# EAGLE design Arduino MEGA blank shield (EAGLE 5.11)
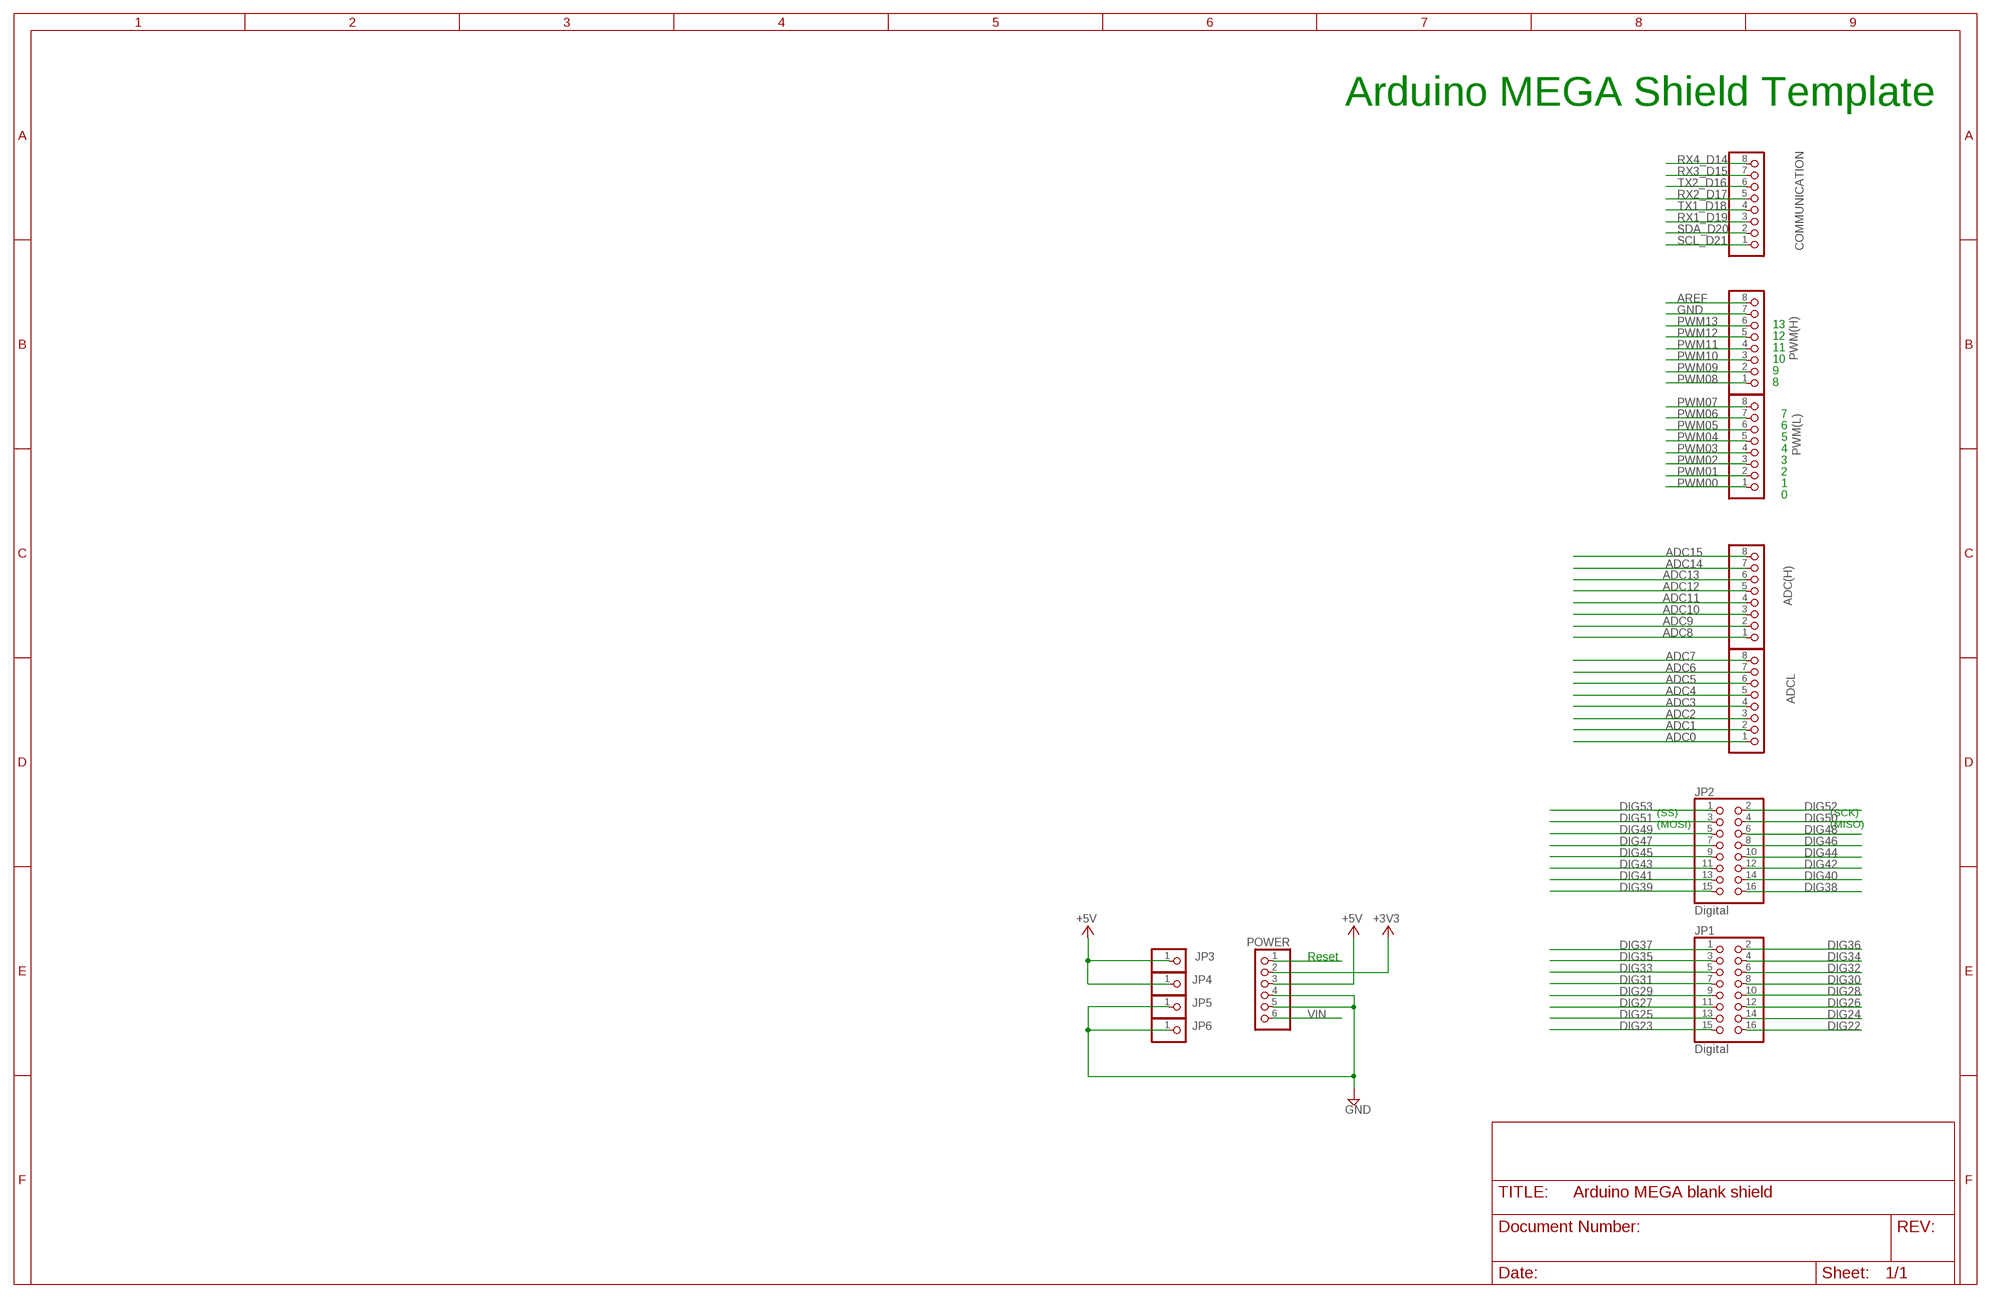
[diagram p0: schematic, sheet 1]

## Parts
ADC(H)  PINHD-1X8  [1X08]
ADCL  PINHD-1X8  [1X08]
COMMUNICATION  PINHD-1X8  [1X08]
JP1  Digital  PINHD-2X8  [2X08]
JP2  Digital  PINHD-2X8  [2X08]
JP3  PINHD-1X1  [1X01]
JP4  PINHD-1X1  [1X01]
JP5  PINHD-1X1  [1X01]
JP6  PINHD-1X1  [1X01]
POWER  PINHD-1X6  [1X06]
PWM(H)  PINHD-1X8  [1X08]
PWM(L)  PINHD-1X8  [1X08]

## Nets
+3V3 [power]: POWER.2
+5V [usbvcc]: JP3.1 JP4.1 POWER.3
ADC0: ADCL.1
ADC1: ADCL.2
ADC2: ADCL.3
ADC3: ADCL.4
ADC4: ADCL.5
ADC5: ADCL.6
ADC6: ADCL.7
ADC7: ADCL.8
ADC8: ADC(H).1
ADC9: ADC(H).2
ADC10: ADC(H).3
ADC11: ADC(H).4
ADC12: ADC(H).5
ADC13: ADC(H).6
ADC14: ADC(H).7
ADC15: ADC(H).8
AREF: PWM(H).8
DIG22: JP1.16
DIG23: JP1.15
DIG24: JP1.14
DIG25: JP1.13
DIG26 [gnd]: JP1.12
DIG27: JP1.11
DIG28: JP1.10
DIG29: JP1.9
DIG30: JP1.8
DIG31: JP1.7
DIG32: JP1.6
DIG33: JP1.5
DIG34: JP1.4
DIG35: JP1.3
DIG36: JP1.2
DIG37: JP1.1
DIG38: JP2.16
DIG39: JP2.15
DIG40: JP2.14
DIG41: JP2.13
DIG42: JP2.12
DIG43: JP2.11
DIG44: JP2.10
DIG45: JP2.9
DIG46: JP2.8
DIG47: JP2.7
DIG48: JP2.6
DIG49: JP2.5
DIG50: JP2.4
DIG51: JP2.3
DIG52: JP2.2
DIG53: JP2.1
GND [gnd]: JP5.1 JP6.1 POWER.4 POWER.5 PWM(H).7
PWM00: PWM(L).1
PWM01: PWM(L).2
PWM02: PWM(L).3
PWM03: PWM(L).4
PWM04: PWM(L).5
PWM05: PWM(L).6
PWM06: PWM(L).7
PWM07: PWM(L).8
PWM08: PWM(H).1
PWM09: PWM(H).2
PWM10: PWM(H).3
PWM11: PWM(H).4
PWM12: PWM(H).5
PWM13: PWM(H).6
RESET: POWER.1
RX1_D19: COMMUNICATION.3
RX2_D17: COMMUNICATION.5
RX3_D15: COMMUNICATION.7
RX4_D14: COMMUNICATION.8
SCL_D21: COMMUNICATION.1
SDA_D20: COMMUNICATION.2
TX1_D18: COMMUNICATION.4
TX2_D16: COMMUNICATION.6
VIN [power]: POWER.6

## Notes on the sheet
- Arduino MEGA Shield Template
- 13
- 12
- 11
- 10
- 9
- 8
- 7
- 6
- 5
- 4
- 3
- 2
- 1
- 0
- (SS) | (SCK)
- (MOSI) | (MISO)
- Reset

## Library data of the parts
ADC(H) ADCL COMMUNICATION PWM(H) PWM(L) = pinhead:PINHD-1X8: PIN HEADER
JP1 JP2 = pinhead:PINHD-2X8: PIN HEADER
JP3-JP6 = pinhead:PINHD-1X1: PIN HEADER
POWER = pinhead:PINHD-1X6: PIN HEADER

## Net classes
0 default: width 0.203 mm, drill 0.406 mm, clearance 0.203 mm
1 power: width 0.61 mm, drill 0.711 mm, clearance 0.203 mm
2 gnd: width 0.305 mm, drill 0.711 mm, clearance 0.203 mm
3 usbvcc: width 0.508 mm, drill 0.711 mm, clearance 0.203 mm

## Board
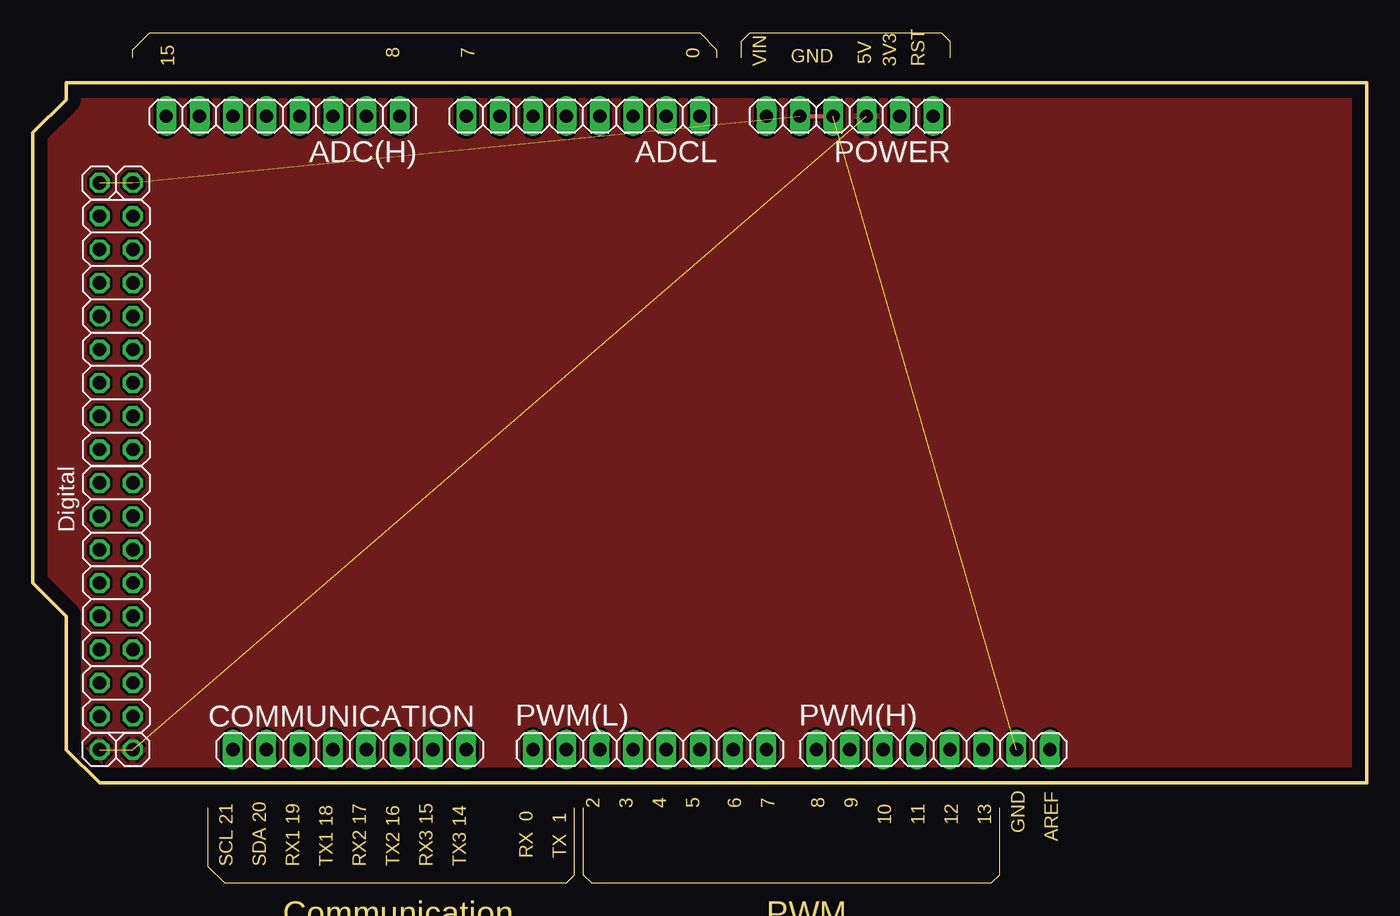
[diagram p1: board, top side]
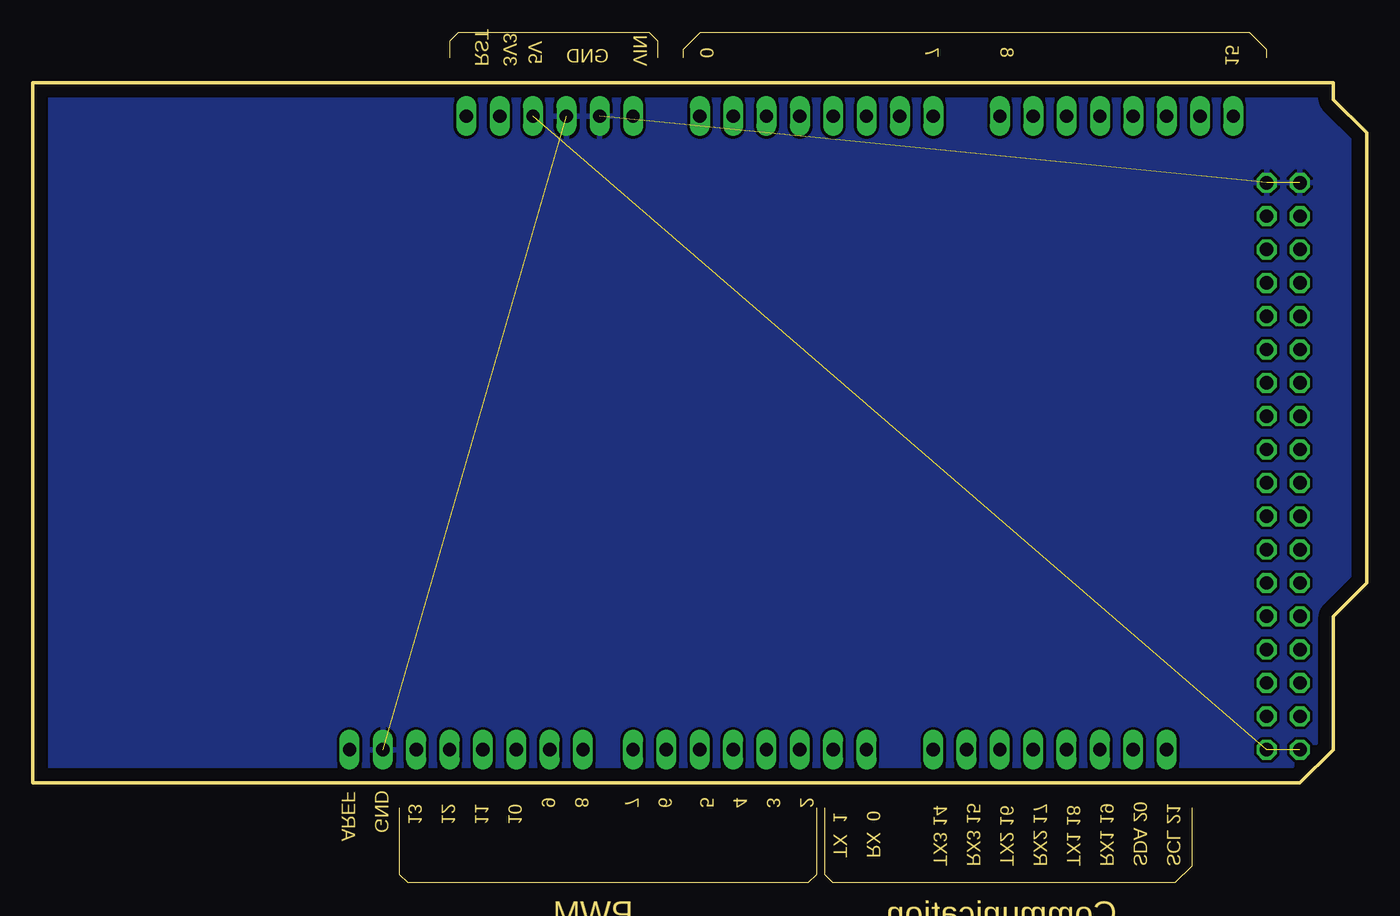
[diagram p2: board, bottom side, seen from below]

Size 101.6 x 64.77 mm. Coordinates in mm from the lower left corner, seen from the top.
Outline: 7.62,62.87 7.62,63.5 8.89,64.77 50.8,64.77 52.07,63.5 52.07,62.87
Outline: 53.98,62.87 53.98,64.13 54.61,64.77 69.22,64.77 69.85,64.13 69.85,62.87
Outline: 13.34,5.71 13.34,1.27 14.61,0 40.64,0 41.27,0.64 41.27,5.71
Outline: 41.91,5.71 41.91,0.64 42.55,0 73.03,0 73.66,0.64 73.66,5.71
Outline: 101.6,7.62 5.08,7.62 2.54,10.16 2.54,20.32 0,22.86 0,57.15 2.54,59.69 2.54,60.96 101.6,60.96 101.6,7.62
Copper layers (1*16): Top 0.035mm / dielectric 1.5mm / Bottom 0.035mm
Design rules "default *": minimum track width 8mil, minimum drill 16mil, track to track 8mil, track to pad 8mil, pad to pad 8mil, via to via 10mil, smd to smd 8mil, copper to edge 40mil, drill to drill 12mil, minimum pad ring 10mil, minimum via ring 10mil, stop-mask expansion 4mil, vias tented up to drill 0mil, thermal gap 10mil

### Footprints (pad centres in the part's own frame; a part is rotated, then mirrored left to right if it is on the bottom)
1X08 = drill 1.016 long: 1 -8.89,0; 2 -6.35,0; 3 -3.81,0; 4 -1.27,0; 5 1.27,0; 6 3.81,0; 7 6.35,0; 8 8.89,0
2X08 = drill 1.016 octagon: 1 -8.89,-1.27; 2 -8.89,1.27; 3 -6.35,-1.27; 4 -6.35,1.27; 5 -3.81,-1.27; 6 -3.81,1.27; 7 -1.27,-1.27; 8 -1.27,1.27; 9 1.27,-1.27; 10 1.27,1.27; 11 3.81,-1.27; 12 3.81,1.27; 13 6.35,-1.27; 14 6.35,1.27; 15 8.89,-1.27; 16 8.89,1.27
1X01 = drill 1.016 octagon: 1 0,0
1X06 = drill 1.016 long: 1 -6.35,0; 2 -3.81,0; 3 -1.27,0; 4 1.27,0; 5 3.81,0; 6 6.35,0

### Placement (x,y rotation side)
ADC(H)  19.05,58.42 180 top
ADCL  41.91,58.42 180 top
COMMUNICATION  24.13,10.16 0 top
JP1  6.35,21.59 270 top
JP2  6.35,41.91 270 top
JP3  7.62,10.16 180 top
JP4  5.08,10.16 180 top
JP5  7.62,53.34 180 top
JP6  5.08,53.34 180 top
POWER  62.23,58.42 180 top
PWM(H)  68.58,10.16 0 top
PWM(L)  46.99,10.16 0 top

### Tracks (layer width: path | path; a pad name or v marks a point on that pad's centre or on a via)
+5V  (2 unrouted)
  pour Top: -1.27,60.96 -1.27,6.98 103.5,6.98 103.5,60.96
GND  (3 unrouted)
  Top 0.305: POWER.5 POWER.4
  pour Bottom: 0,60.96 102.23,60.96 102.23,59.69 102.23,6.98 -0.63,6.98 -0.63,8.89

### Text on the board
Dimension: 5V | 3V3 | GND | 15 | 8 | 7 | 0 | VIN | RST | 2 | 3 | 4 | 5 | 6 | 7 | 8 | 9 | 10 | 11 | 12 | 13 | GND | AREF | SCL 21 | SDA 20 | RX1 19 | TX1 18 | RX2 17 | TX2 16 | RX3 15 | TX3 14 | RX 0 | TX 1 | Communication | PWM
tOrigins: Analog In | Power